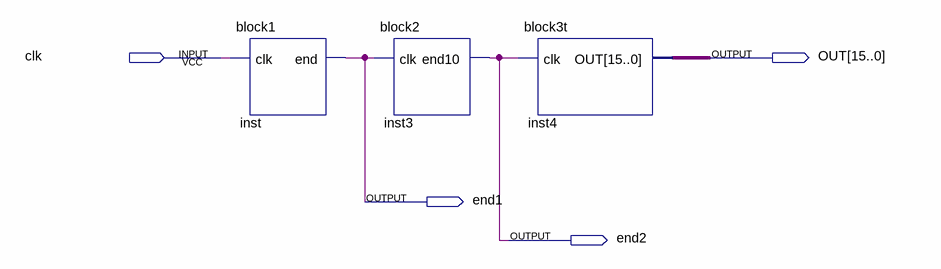
[diagram p0: schematic sheet]
// Quartus schematic result.bdf as structural Verilog: 3 symbols, 4 pins
module result (
  input  clk,
  output [15:0] OUT,
  output end1,
  output end2
);

  block1 inst (.clk(clk), .\end (end1));
  block2 inst3 (.clk(end1), .end10(end2));
  block3t inst4 (.clk(end2), .OUT(OUT));
endmodule
